# Altium schematic sheet Board-PWM.SchDoc: =ProjectTitle
size 297 x 209 mm; Address1: Address1; Address2: Address2; Address3: Address3; Address4: Address4; SheetNumber: 3; SheetTotal: 6; Scale: 1:1; DocumentType: Схема электрическая принципиальная; Title2str: ?
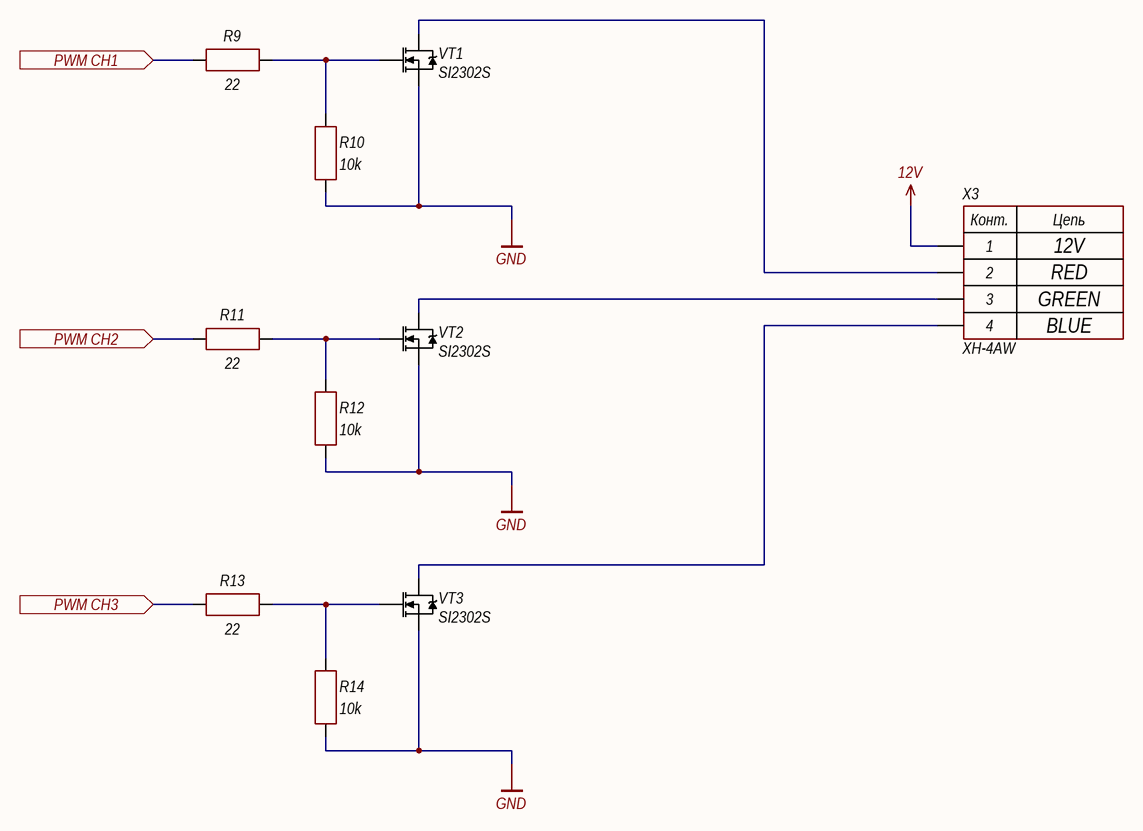
[diagram p0: Board-PWM.SchDoc]

## Parts
R9  22  [CH0402R]
R10  10k  [CH0402R]
R11  22  [CH0402R]
R12  10k  [CH0402R]
R13  22  [CH0402R]
R14  10k  [CH0402R]
VT1  SI2302S  [SOT23_123]
VT2  SI2302S  [SOT23_123]
VT3  SI2302S  [SOT23_123]
X3  XH-4AW  [CON: XH-4AW]

## Ports
PWM CH1 (in), PWM CH2 (in), PWM CH3 (in)

## Nets
12V: X3.1
GND: R10.1 R12.1 R14.1 VT1.3(S) VT2.3(S) VT3.3(S)
PWM CH1: R9.1 ; port PWM CH1
PWM CH2: R11.1 ; port PWM CH2
PWM CH3: R13.1 ; port PWM CH3
NetR9_2: R9.2 R10.2 VT1.1(G)
NetR11_2: R11.2 R12.2 VT2.1(G)
NetR13_2: R13.2 R14.2 VT3.1(G)
NetVT1_2: VT1.2(D) X3.2
NetVT2_2: VT2.2(D) X3.3
NetVT3_2: VT3.2(D) X3.4

## Notes on the sheet
- 12V
- RED
- GREEN
- BLUE
- Изм.
- Лист
- № докум.
- Подп.
- Дата
- Копировал
- Формат А4
- (in symbol 4-Connector) Конт.; Цепь

## Library data of the parts
R9 R11 R13 = Resistor: Manufacturer: YAGEO; Model: RC0402FR-0722RL; HelpURL: https://lcsc.com/product-detail/Chip-Resistor-Surface-Mount_22R-22R0-1_C114765.html; ComponentKind: ±1%; Value: 22
R10 R12 R14 = Resistor: Manufacturer: Uniroyal Elec; Model: 0402WGF1002TCE; HelpURL: https://lcsc.com/product-detail/Chip-Resistor-Surface-Mount_UNI-ROYAL-Uniroyal-Elec-0402WGF1002TCE_C25744.html; ComponentKind: ±1%; Value: 10k
VT1-VT3 = N-chanel: Mosfet; Manufacturer: Microdiode Electronics; Model: SI2302S; ComponentKind: 20V, 2.3A, 1.5V; HelpURL: https://lcsc.com/product-detail/MOSFET_MDD-Microdiode-Electronics-SI2302S_C427388.html
X3 = 4-Connector: Model: XH-4AW; Manufacturer: *; HelpURL: *; ComponentKind: *